# EAGLE design Teensy3.2_v3_final (EAGLE 7.6.0)
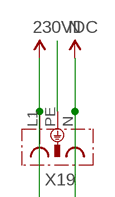
[diagram p0: schematic, sheet 1, part 1 of 3]
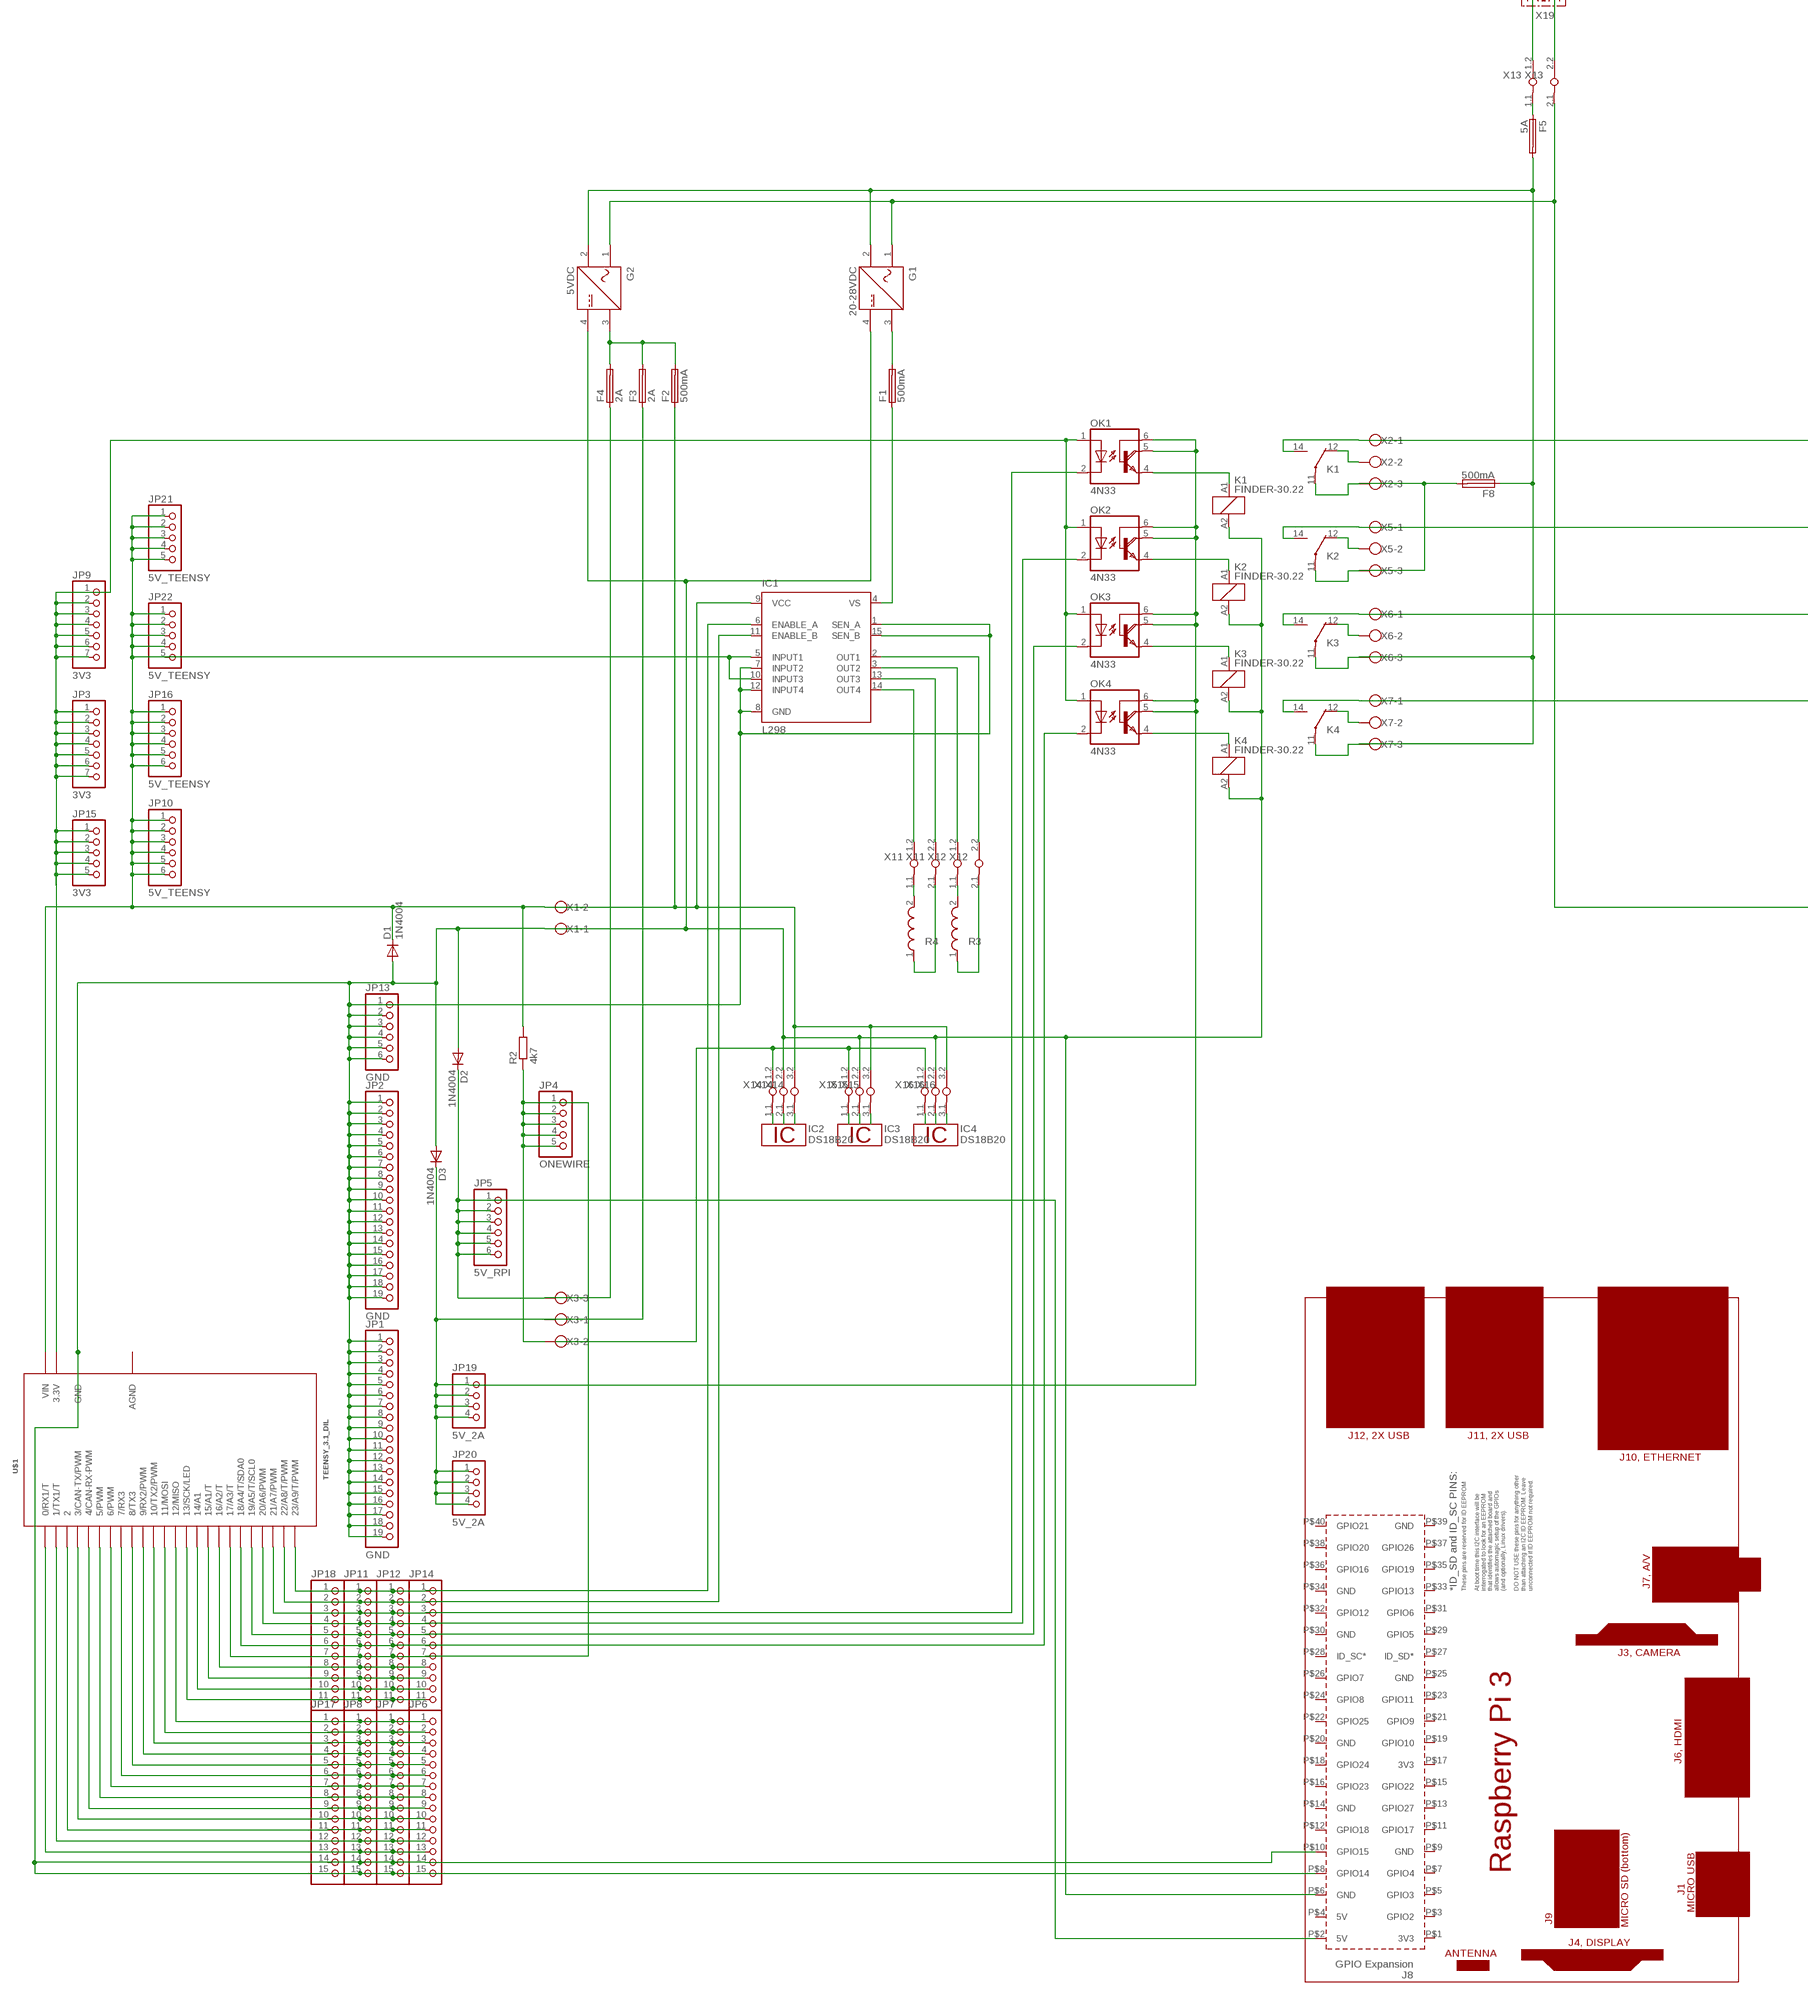
[diagram p1: schematic, sheet 1, part 2 of 3]
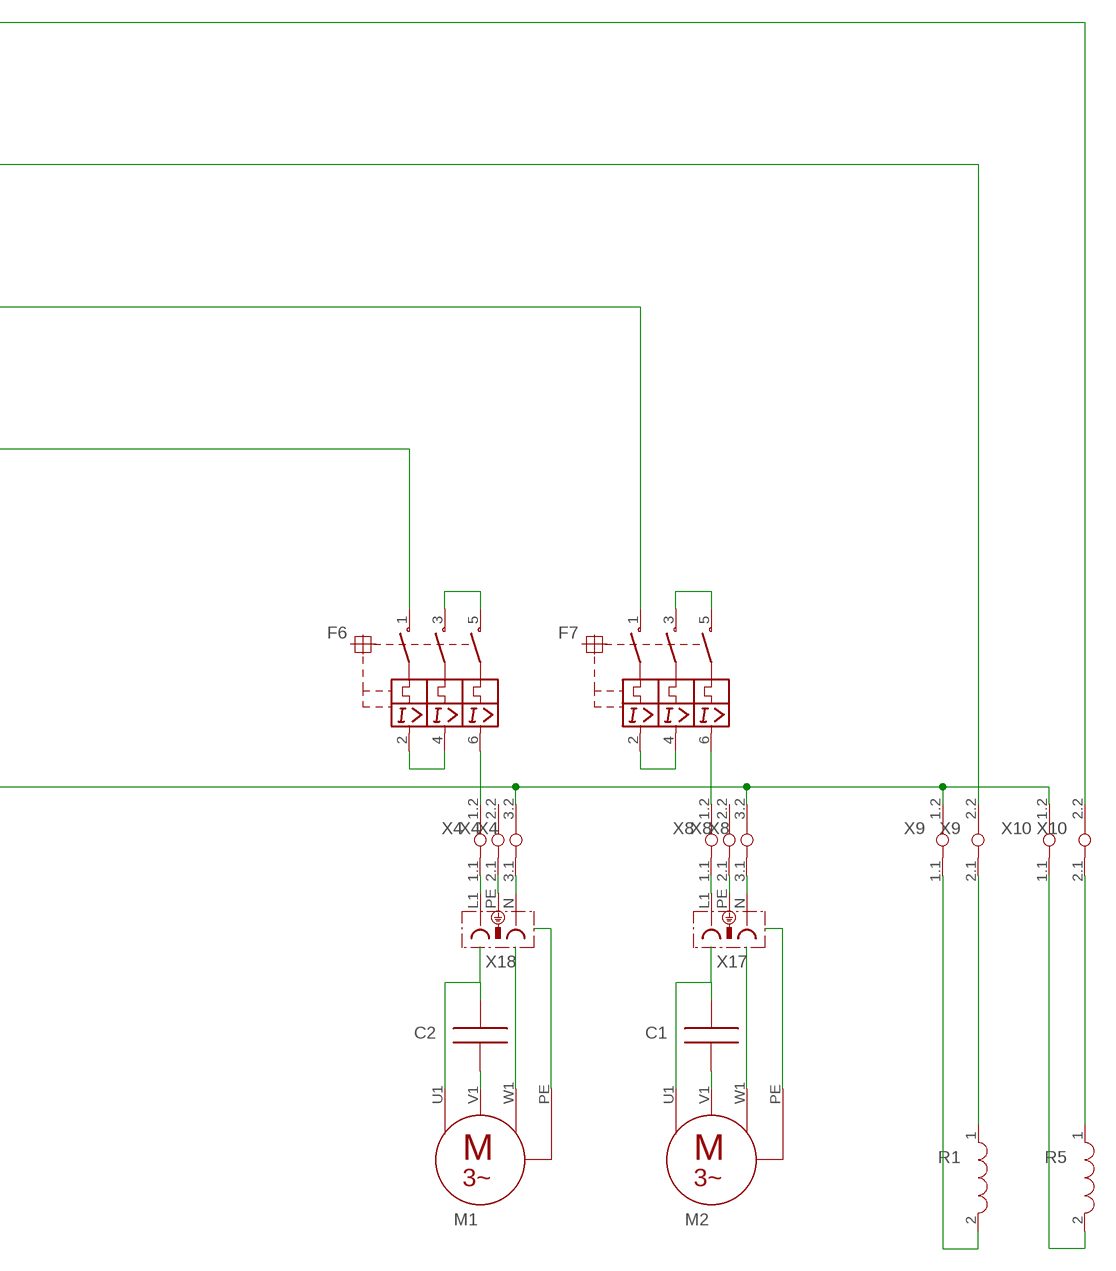
[diagram p2: schematic, sheet 1, part 3 of 3]

## Parts
C1  KONDENSATOR_KAPAZITAET_ALLGEMEIN  [KONDENSATOR_KAPAZITAET_ALLGEMEIN]
C2  KONDENSATOR_KAPAZITAET_ALLGEMEIN  [KONDENSATOR_KAPAZITAET_ALLGEMEIN]
D1  1N4004  [DO41-10]
D2  1N4004  [DO41-10]
D3  1N4004  [DO41-10]
F1  500mA  GSH15  [GSH15]
F2  500mA  GSH15  [GSH15]
F3  2A  GSH15  [GSH15]
F4  2A  GSH15  [GSH15]
F5  5A  GSH15  [GSH15]
F6  MOTORSCHUTZSCHALTER_3-POL_THERM_MAG_HANDBETAETIGT  [MOTORSCHUTZSCHALTER_3-POL_THERM_MAG_HANDBETAETIGT]
F7  MOTORSCHUTZSCHALTER_3-POL_THERM_MAG_HANDBETAETIGT  [MOTORSCHUTZSCHALTER_3-POL_THERM_MAG_HANDBETAETIGT]
F8  500mA  GSH15  [GSH15]
G1  20-28VDC  NETZTEIL_GLEICHSPANNUNG  [NETZTEIL_GLEICHSPANNUNG]
G2  5VDC  NETZTEIL_GLEICHSPANNUNG  [NETZTEIL_GLEICHSPANNUNG]
IC1  L298  [MULTIWATT-15]
IC2  DS18B20  [TO92-]
IC3  DS18B20  [TO92-]
IC4  DS18B20  [TO92-]
JP1  GND  PINHD-1X19  [1X19]
JP2  GND  PINHD-1X19  [1X19]
JP3  3V3  PINHD-1X7  [1X07]
JP4  ONEWIRE  PINHD-1X5  [1X05]
JP5  5V_RPI  PINHD-1X6  [1X06]
JP6  PINHD-1X15  [1X15]
JP7  PINHD-1X15  [1X15]
JP8  PINHD-1X15  [1X15]
JP9  3V3  PINHD-1X7  [1X07]
JP10  5V_TEENSY  PINHD-1X6  [1X06]
JP11  PINHD-1X11  [1X11]
JP12  PINHD-1X11  [1X11]
JP13  GND  PINHD-1X6  [1X06]
JP14  PINHD-1X11  [1X11]
JP15  3V3  PINHD-1X5  [1X05]
JP16  5V_TEENSY  PINHD-1X6  [1X06]
JP17  PINHD-1X15  [1X15]
JP18  PINHD-1X11  [1X11]
JP19  5V_2A  PINHD-1X4  [1X04]
JP20  5V_2A  PINHD-1X4  [1X04]
JP21  5V_TEENSY  PINHD-1X5  [1X05]
JP22  5V_TEENSY  PINHD-1X5  [1X05]
K1  FINDER-30.22  [FINDER-30.22]
K2  FINDER-30.22  [FINDER-30.22]
K3  FINDER-30.22  [FINDER-30.22]
K4  FINDER-30.22  [FINDER-30.22]
M1  MOTOR_3-POL_PE  [MOTOR_3-POL_PE]
M2  MOTOR_3-POL_PE  [MOTOR_3-POL_PE]
OK1  4N33  [DIL06]
OK2  4N33  [DIL06]
OK3  4N33  [DIL06]
OK4  4N33  [DIL06]
PCB1  RPI3  [RPI3]
R1  SPULE_ALTERNATIV  [SPULE]
R2  4k7  R-EU_0204/5  [0204/5]
R3  SPULE_ALTERNATIV  [SPULE]
R4  SPULE_ALTERNATIV  [SPULE]
R5  SPULE_ALTERNATIV  [SPULE]
U$1  TEENSY_3.1_DIL  [TEENSY3-DIL]
X1  W237-102  [W237-102]
X2  W237-103  [W237-103]
X3  W237-103  [W237-103]
X4  KLEMME_1-3  [KLEMME_1-3]
X5  W237-103  [W237-103]
X6  W237-103  [W237-103]
X7  W237-103  [W237-103]
X8  KLEMME_1-3  [KLEMME_1-3]
X9  KLEMME_1-2  [KLEMME_1-2]
X10  KLEMME_1-2  [KLEMME_1-2]
X11  KLEMME_1-2  [KLEMME_1-2]
X12  KLEMME_1-2  [KLEMME_1-2]
X13  KLEMME_1-2  [KLEMME_1-2]
X14  KLEMME_1-3  [KLEMME_1-3]
X15  KLEMME_1-3  [KLEMME_1-3]
X16  KLEMME_1-3  [KLEMME_1-3]
X17  STECKDOSE  [STECKDOSE]
X18  STECKDOSE  [STECKDOSE]
X19  STECKDOSE  [STECKDOSE]

## Nets
0V: D1.A D2.A D3.A G1.4 G2.4 IC1.1(SEN_A) IC1.7(INPUT2) IC1.8(GND) IC1.12(INPUT4) IC1.15(SEN_B) JP1.1 JP1.2 JP1.3 JP1.4 JP1.5 JP1.6 JP1.7 JP1.8 JP1.9 JP1.10 JP1.11 JP1.12 JP1.13 JP1.14 JP1.15 JP1.16 JP1.17 JP1.18 JP1.19 JP2.1 JP2.2 JP2.3 JP2.4 JP2.5 JP2.6 JP2.7 JP2.8 JP2.9 JP2.10 JP2.11 JP2.12 JP2.13 JP2.14 JP2.15 JP2.16 JP2.17 JP2.18 JP2.19 JP6.14 JP6.15 JP7.14 JP7.15 JP8.14 JP8.15 JP13.1 JP13.2 JP13.3 JP13.4 JP13.5 JP13.6 JP17.14 JP17.15 K1.A2 K2.A2 K3.A2 K4.A2 PCB1.P$6(GND) PCB1.P$8(GPIO14) PCB1.P$10(GPIO15) U$1.GND X1.1 X14.2.2(2:2.2) X15.2.2(2:2.2) X16.2.2(2:2.2)
5V_0,5A: D1.C F2.1 IC1.5(INPUT1) IC1.9(VCC) IC1.10(INPUT3) JP10.1 JP10.2 JP10.3 JP10.4 JP10.5 JP10.6 JP16.1 JP16.2 JP16.3 JP16.4 JP16.5 JP16.6 JP21.1 JP21.2 JP21.3 JP21.4 JP21.5 JP22.1 JP22.2 JP22.3 JP22.4 JP22.5 R2.2 U$1.VIN X1.2 X14.3.2(3:3.2) X15.3.2(3:3.2) X16.3.2(3:3.2)
5V_1A: D3.C F3.1 JP19.1 JP19.2 JP19.3 JP19.4 JP20.1 JP20.2 JP20.3 JP20.4 OK1.5(COL) OK1.6(B) OK2.5(COL) OK2.6(B) OK3.5(COL) OK3.6(B) OK4.5(COL) OK4.6(B) X3.1
5V_2A: D2.C F4.1 JP5.1 JP5.2 JP5.3 JP5.4 JP5.5 JP5.6 PCB1.P$2(5V) X3.3
N$1: JP4.1 JP4.2 JP4.3 JP4.4 JP4.5 JP11.7 JP12.7 JP14.7 JP18.7 R2.1 U$1.17/A3(17/A3/T) X3.2
N$2: F8.2 K1.11(-1:P) K2.11(-1:P) X2.3 X5.3
N$3: X19.PE
N$4: R4.2 X11.1.1(1:1.1)
N$5: JP6.13 JP7.13 JP8.13 JP17.13 U$1.0(0/RX1/T)
N$6: X14.1.2(1:1.2) X15.1.2(1:1.2) X16.1.2(1:1.2)
N$7: JP6.11 JP7.11 JP8.11 JP17.11 U$1.2
N$8: JP6.10 JP7.10 JP8.10 JP17.10 U$1.3(3/CAN-TX/PWM)
N$9: JP6.9 JP7.9 JP8.9 JP17.9 U$1.4(4/CAN-RX-PWM)
N$10: JP6.8 JP7.8 JP8.8 JP17.8 U$1.5(5/PWM)
N$11: JP6.7 JP7.7 JP8.7 JP17.7 U$1.6(6/PWM)
N$12: JP6.6 JP7.6 JP8.6 JP17.6 U$1.7(7/RX3)
N$13: JP6.5 JP7.5 JP8.5 JP17.5 U$1.8(8/TX3)
N$14: JP6.4 JP7.4 JP8.4 JP17.4 U$1.9(9/RX2/PWM)
N$15: JP6.3 JP7.3 JP8.3 JP17.3 U$1.10(10/TX2/PWM)
N$16: JP6.2 JP7.2 JP8.2 JP17.2 U$1.11(11/MOSI)
N$17: R4.1 X11.2.1(2:2.1)
N$18: JP6.1 JP7.1 JP8.1 JP17.1 U$1.12(12/MISO)
N$19: JP11.11 JP12.11 JP14.11 JP18.11 U$1.13(13/SCK/LED)
N$20: JP11.10 JP12.10 JP14.10 JP18.10 U$1.14/A0(14/A1)
N$21: JP11.9 JP12.9 JP14.9 JP18.9 U$1.15/A1(15/A1/T)
N$22: JP11.8 JP12.8 JP14.8 JP18.8 U$1.16/A2(16/A2/T)
N$23: F1.2 G1.3
N$24: JP11.6 JP12.6 JP14.6 JP18.6 OK4.2(C) U$1.18/A4(18/A4/T/SDA0)
N$25: R3.2 X12.1.1(1:1.1)
N$26: JP11.5 JP12.5 JP14.5 JP18.5 OK3.2(C) U$1.19/A5(19/A5/T/SCL0)
N$27: JP11.4 JP12.4 JP14.4 JP18.4 OK2.2(C) U$1.20/A6(20/A6/PWM)
N$28: JP11.3 JP12.3 JP14.3 JP18.3 OK1.2(C) U$1.21/A7(21/A7/PWM)
N$29: IC1.11(ENABLE_B) JP11.2 JP12.2 JP14.2 JP18.2 U$1.22/A8(22/A8/T/PWM)
N$30: IC1.6(ENABLE_A) JP11.1 JP12.1 JP14.1 JP18.1 U$1.23/A9(23/A9/T/PWM)
N$31: K1.A1 OK1.4(E)
N$32: JP6.12 JP7.12 JP8.12 JP17.12 U$1.1(1/TX1/T)
N$33: JP3.1 JP3.2 JP3.3 JP3.4 JP3.5 JP3.6 JP3.7 JP9.1 JP9.2 JP9.3 JP9.4 JP9.5 JP9.6 JP9.7 JP15.1 JP15.2 JP15.3 JP15.4 JP15.5 OK1.1(A) OK2.1(A) OK3.1(A) OK4.1(A) U$1.3.3V
N$34: R3.1 X12.2.1(2:2.1)
N$35: F5.1 X13.1.1(1:1.1)
N$37: K1.12(-1:O) X2.2
N$38: F5.2 F8.1 G1.2 G2.2 K3.11(-1:P) K4.11(-1:P) X6.3 X7.3
N$39: F6.2 F6.4
N$40: K4.A1 OK4.4(E)
N$41: K3.A1 OK3.4(E)
N$42: K2.A1 OK2.4(E)
N$43: F6.3 F6.5
N$44: F6.6 X4.1.2(1:1.2)
N$45: F6.1 F7.1 K2.14(-1:S) X5.1 X9.2.2(2:2.2)
N$46: K2.12(-1:O) X5.2
N$47: F7.2 F7.4
N$48: K3.14(-1:S) X6.1
N$49: K3.12(-1:O) X6.2
N$50: F7.3 F7.5
N$51: K4.14(-1:S) X7.1
N$52: K4.12(-1:O) X7.2
N$53: X4.1.1(1:1.1) X18.L1
N$54: C2.2 M1.V1
N$55: C1.2 M2.V1
N$57: K1.14(-1:S) X2.1 X10.2.2(2:2.2)
N$58: C2.1 M1.U1
N$59: X4.2.1(2:2.1) X18.PE
N$60: C1.1 M2.U1
N$61: X4.3.1(3:3.1) X18.N
N$62: R1.2 X9.1.1(1:1.1)
N$63: R1.1 X9.2.1(2:2.1)
N$64: R5.2 X10.1.1(1:1.1)
N$65: R5.1 X10.2.1(2:2.1)
N$66: X8.3.1(3:3.1) X17.N
N$67: X8.1.1(1:1.1) X17.L1
N$68: IC1.14(OUT4)
N$69: IC1.13(OUT3) X11.2.2(2:2.2)
N$70: IC1.3(OUT2)
N$71: IC1.2(OUT1) X12.2.2(2:2.2)
N$74: G1.1 G2.1 X4.3.2(3:3.2) X8.3.2(3:3.2) X9.1.2(1:1.2) X10.1.2(1:1.2) X13.2.1(2:2.1)
N$75: F1.1 IC1.4(VS)
N$76: F2.2 F3.2 F4.2 G2.3
N$78: X14.1.1(1:1.1)
N$79: X14.2.1(2:2.1)
N$80: X14.3.1(3:3.1)
N$81: X15.1.1(1:1.1)
N$82: X15.2.1(2:2.1)
N$83: X15.3.1(3:3.1)
N$84: X16.1.1(1:1.1)
N$85: X16.2.1(2:2.1)
N$86: X16.3.1(3:3.1)
N$87: F7.6 X8.1.2(1:1.2)
N$88: X8.2.1(2:2.1) X17.PE
N$89: M1.W1
N$90: M1.PE
N$91: M2.W1
N$92: M2.PE
VCC: X13.1.2(1:1.2) X13.2.2(2:2.2) X19.L1 X19.N ; supply symbol labelled 230VDC, N
Unconnected: K1.21(-2:P) K1.22(-2:O) K1.24(-2:S) K2.21(-2:P) K2.22(-2:O) K2.24(-2:S) K3.21(-2:P) K3.22(-2:O) K3.24(-2:S) K4.21(-2:P) K4.22(-2:O) K4.24(-2:S) PCB1.P$1(3V3) PCB1.P$3(GPIO2) PCB1.P$4(5V) PCB1.P$5(GPIO3) PCB1.P$7(GPIO4) PCB1.P$9(GND) PCB1.P$11(GPIO17) PCB1.P$12(GPIO18) PCB1.P$13(GPIO27) PCB1.P$14(GND) PCB1.P$15(GPIO22) PCB1.P$16(GPIO23) PCB1.P$17(3V3) PCB1.P$18(GPIO24) PCB1.P$19(GPIO10) PCB1.P$20(GND) PCB1.P$21(GPIO9) PCB1.P$22(GPIO25) PCB1.P$23(GPIO11) PCB1.P$24(GPIO8) PCB1.P$25(GND) PCB1.P$26(GPIO7) PCB1.P$27(ID_SD*) PCB1.P$28(ID_SC*) PCB1.P$29(GPIO5) PCB1.P$30(GND) PCB1.P$31(GPIO6) PCB1.P$32(GPIO12) PCB1.P$33(GPIO13) PCB1.P$34(GND) PCB1.P$35(GPIO19) PCB1.P$36(GPIO16) PCB1.P$37(GPIO26) PCB1.P$38(GPIO20) PCB1.P$39(GND) PCB1.P$40(GPIO21) X4.2.2(2:2.2) X8.2.2(2:2.2) X11.1.2(1:1.2) X12.1.2(1:1.2)

## Power pins joined to a net without a drawn wire
1W: IC2.2 IC3.2 IC4.2
AGND: U$1.AGND
GND: IC2.1 IC3.1 IC4.1
VDD: IC2.3 IC3.3 IC4.3

## Library data of the parts
C1 C2 = e-kondensatoren:KONDENSATOR_KAPAZITAET_ALLGEMEIN: Kondensator / Kapazität allgemein
D1-D3 = diode:1N4004: DIODE general purpose rectifier, 1 A
F1-F5 F8 = fuse:GSH15: FUSE HOLDER grid 15mm, 19649 Wickmann; MPN: 64900001039; OC_FARNELL: 1271673; OC_NEWARK: 02P0318
F6 F7 = e-motorschutzschalter:MOTORSCHUTZSCHALTER_3-POL_THERM_MAG_HANDBETAETIGT: Motorschutzschalter 3-pol. mit thermischer Auslösung, Handbetätigt
G1 G2 = e-stromversorgungselemente:NETZTEIL_GLEICHSPANNUNG: Netzteil, Gleichspannung
IC1 = st-microelectronics:L298: DUAL FULL-BRIDGE DRIVER; MPN: L298N; OC_FARNELL: 1589425; OC_NEWARK: 32M1527
IC2-IC4 = 1wire:DS18B20: Programmable Resolution Digital Thermometer This chip provides a onewire thermosensor with approx. 0.5°C accuracy. A programmable over/undertemperure alarm is available. The precision can be set from 9..12 bits. Notes: Vdd must be applied for accurate measurements at low temperatures, as the parasite power circuit otherwise heats the sensor. If parasite power is used, Vdd has to be connected to GND. The DS1822 is a low-cost thermometer chip, the DS18S20 is similar to the DS18B20, but with 9 Bit precision only. Author: Jan Kandziora <jjj@gmx.de>
JP1 JP2 = pinhead:PINHD-1X19: PIN HEADER
JP3 JP9 = pinhead:PINHD-1X7: PIN HEADER
JP4 JP15 JP21 JP22 = pinhead:PINHD-1X5: PIN HEADER
JP5 JP10 JP13 JP16 = pinhead:PINHD-1X6: PIN HEADER
JP6-JP8 JP17 = pinhead:PINHD-1X15: PIN HEADER
JP11 JP12 JP14 JP18 = pinhead:PINHD-1X11: PIN HEADER
JP19 JP20 = pinhead:PINHD-1X4: PIN HEADER
K1-K4 = relay:FINDER-30.22: SUBMINIATURE DIL-RELAIS FINDER 30.22.9.024.0000 Kontakt max. AC - 125V Distributor: Farnell Bestell Nr.: 1217371 Source: http://www.farnell.com/datasheets/87634.pdf; OC_FARNELL: unknown; OC_NEWARK: unknown
M1 M2 = e-motoren:MOTOR_3-POL_PE: 3-Phasen-Motor mit PE
OK1-OK4 = optocoupler:4N33: MOTOROLA OPTO COUPLER; MF: VISHAY/TELEFUNKEN; MPN: 4N33; OC_FARNELL: 1469601; OC_NEWARK: 88K1390
PCB1 = e14_Rpi3_RevA:RPI3: Device for Raspberry Pi 3 board created by Dave Young for www.element14.com More information and support community is available at https://www.element14.com/community/community/raspberry-pi
R1 R3-R5 = e-spulen-transformatoren:SPULE_ALTERNATIV: Spule alternativ
R2 = rcl:R-EU_: RESISTOR, European symbol
U$1 = Teensy_3_and_LC_Series_Boards_v1.1:TEENSY_3.1_DIL: Teensy 3.1 or 3.2 in a DIL Layout.
X1 = con-wago-500:W237-102: WAGO SCREW CLAMP; MPN: 237-102; OC_FARNELL: unknown; OC_NEWARK: 70K9898
X2 X3 X5-X7 = con-wago-500:W237-103: WAGO SCREW CLAMP; MPN: 237-103; OC_FARNELL: unknown; OC_NEWARK: 18M7116
X4 X8 X14-X16 = e-klemmen:KLEMME_1-3: Klemme 3 Pol.
X9-X13 = e-klemmen:KLEMME_1-2: Klemme 2 Pol.
X17-X19 = e-steckverbinder:STECKDOSE: Steckdose mit Schutzleiter

## Board
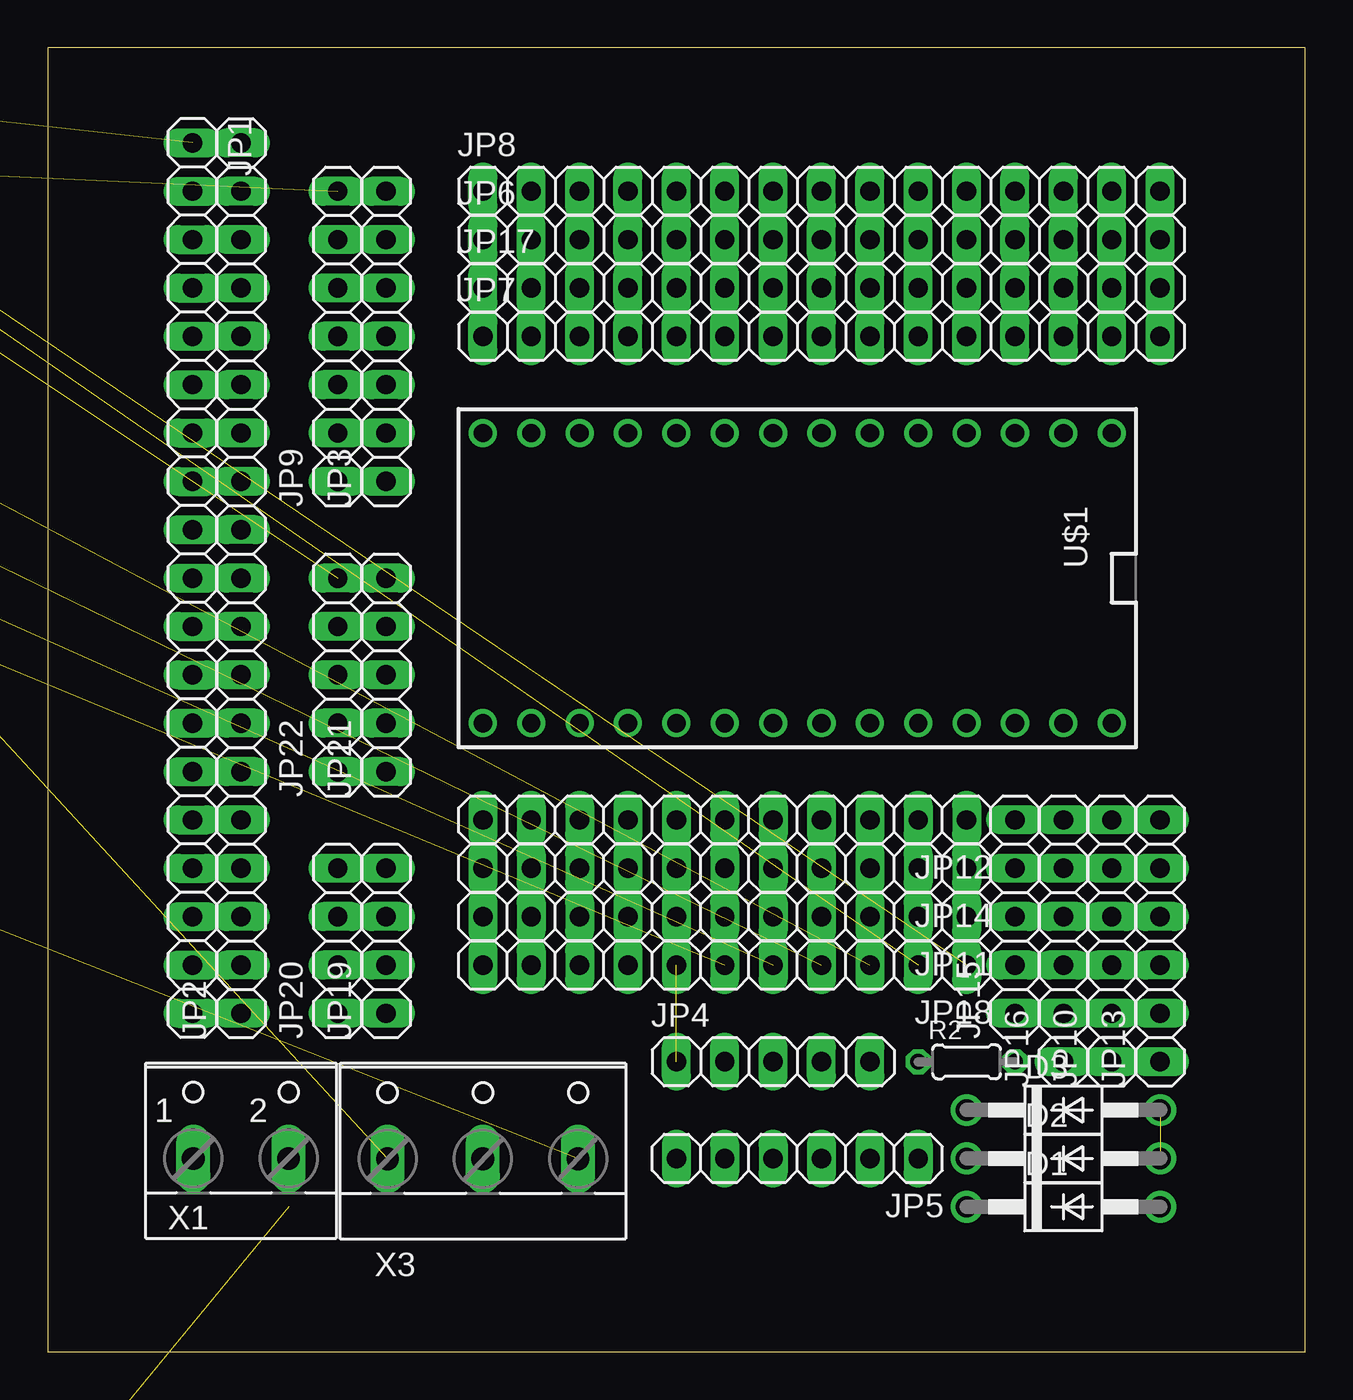
[diagram p3: board, top side]
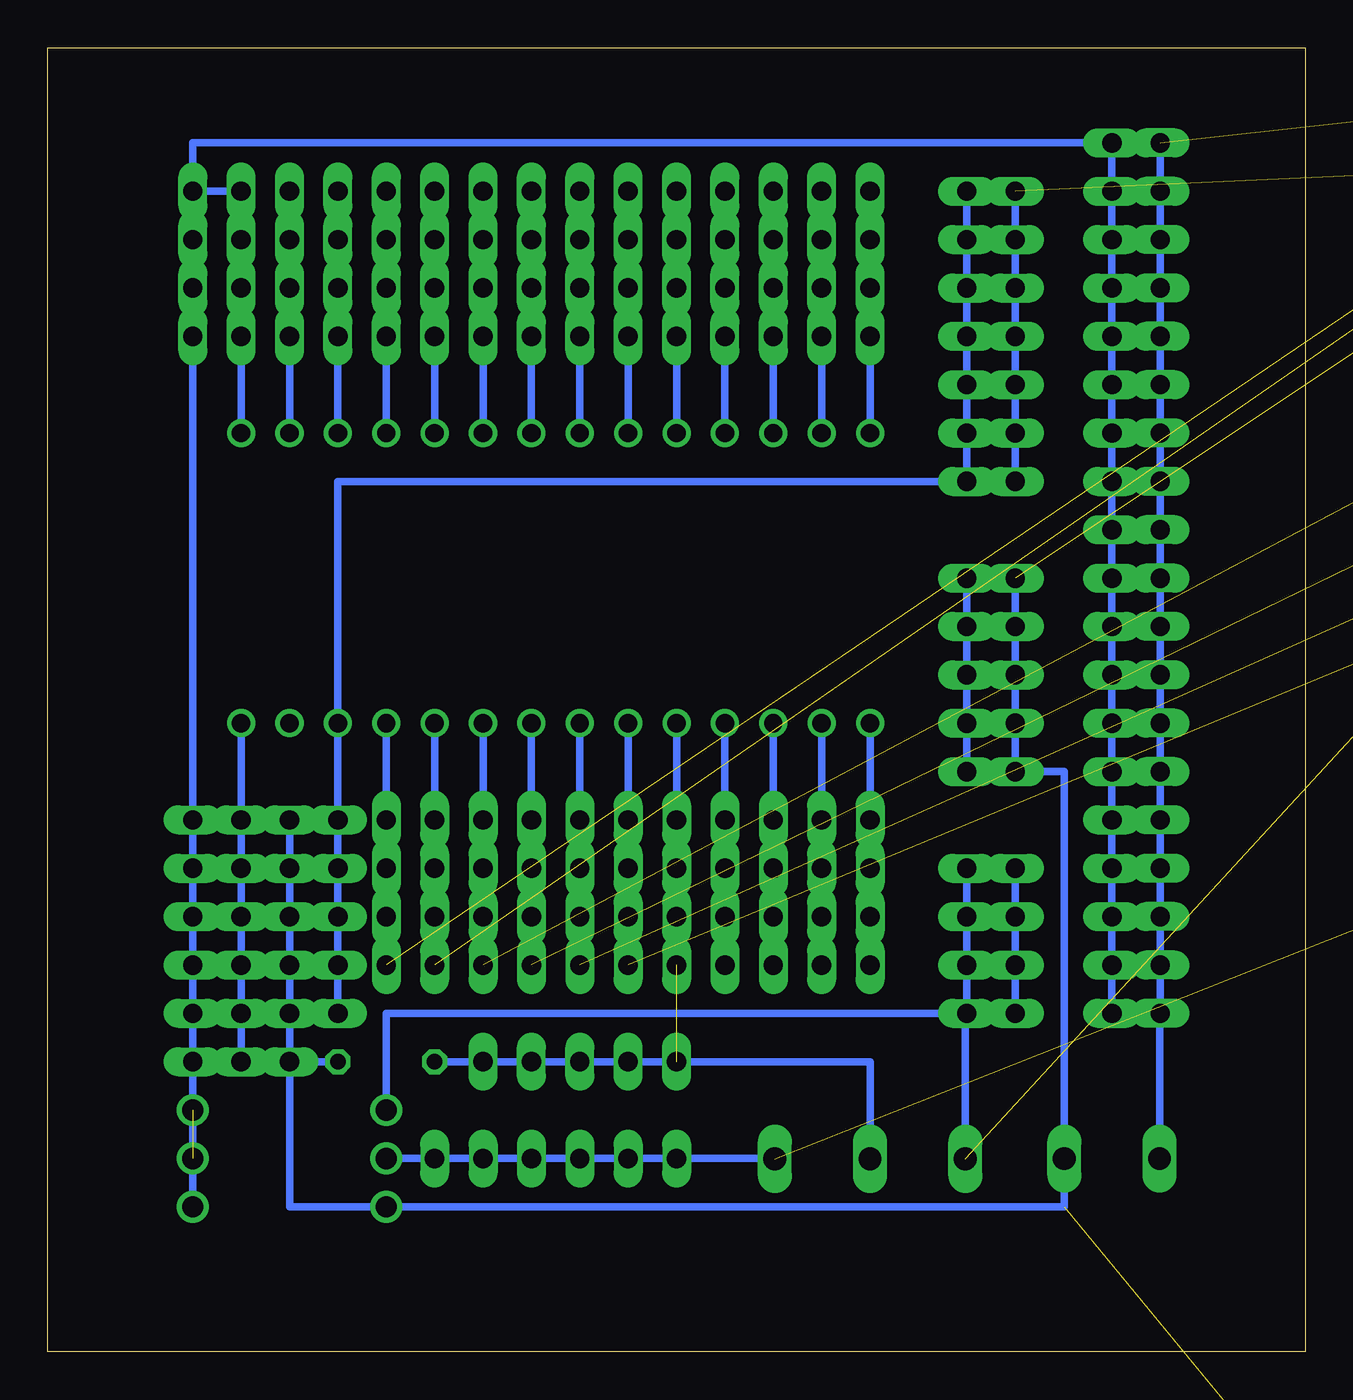
[diagram p4: board, bottom side, seen from below]

Size 66.03 x 68.5 mm. Coordinates in mm from the lower left corner, seen from the top.
Outline: 66.03,0 66.03,68.5 0,68.5 0,0 66.03,0
Copper layers (1*16): Top 0.035mm / dielectric 1.5mm / Bottom 0.035mm
Design rules "default": minimum track width 10mil, minimum drill 24mil, track to track 8mil, track to pad 8mil, pad to pad 8mil, via to via 8mil, smd to smd 8mil, copper to edge 40mil, drill to drill 8mil, minimum pad ring 10mil, minimum via ring 8mil, stop-mask expansion 4mil, vias tented up to drill 0mil, thermal gap 10mil

### Footprints (pad centres in the part's own frame; a part is rotated, then mirrored left to right if it is on the bottom)
KONDENSATOR_KAPAZITAET_ALLGEMEIN = drill 0.2 pad 0.6 square: 1 -5.08,0; 2 5.08,0
DO41-10 = drill 1.118: A 5.08,0; C -5.08,0
GSH15 = drill 1.321 pad 2.54 long: 1 -7.62,0; 2 7.62,0 | hole 2.794: 0,0
MOTORSCHUTZSCHALTER_3-POL_THERM_MAG_HANDBETAETIGT = drill 0.5 pad 1 square: 1 -5.08,0; 2 -5.08,-20.32; 3 0,0; 4 0,-20.32; 5 5.08,0; 6 5.08,-20.32
NETZTEIL_GLEICHSPANNUNG = drill 0.5 pad 1 square: 1 -10.16,-5.08; 2 -10.16,-10.16; 3 10.16,-5.08; 4 10.16,-10.16
MULTIWATT-15 = drill 1.2 long: 1 -8.89,-7.62; 2 -7.62,-2.54; 3 -6.35,-7.62; 4 -5.08,-2.54; 5 -3.81,-7.62; 6 -2.54,-2.54; 7 -1.27,-7.62; 8 0,-2.54; 9 1.27,-7.62; 10 2.54,-2.54; 11 3.81,-7.62; 12 5.08,-2.54; 13 6.35,-7.62; 14 7.62,-2.54; 15 8.89,-7.62
TO92- = drill 0.813 octagon: 1 -2.54,0; 2 0,0; 3 2.54,0
1X19 = drill 1.016 long: 1 -22.86,0; 2 -20.32,0; 3 -17.78,0; 4 -15.24,0; 5 -12.7,0; 6 -10.16,0; 7 -7.62,0; 8 -5.08,0; 9 -2.54,0; 10 0,0; 11 2.54,0; 12 5.08,0; 13 7.62,0; 14 10.16,0; 15 12.7,0; 16 15.24,0; 17 17.78,0; 18 20.32,0; 19 22.86,0
1X07 = drill 1.016 long: 1 -7.62,0; 2 -5.08,0; 3 -2.54,0; 4 0,0; 5 2.54,0; 6 5.08,0; 7 7.62,0
1X05 = drill 1.016 long: 1 -5.08,0; 2 -2.54,0; 3 0,0; 4 2.54,0; 5 5.08,0
1X06 = drill 1.016 long: 1 -6.35,0; 2 -3.81,0; 3 -1.27,0; 4 1.27,0; 5 3.81,0; 6 6.35,0
1X15 = drill 1.016 long: 1 -17.78,0; 2 -15.24,0; 3 -12.7,0; 4 -10.16,0; 5 -7.62,0; 6 -5.08,0; 7 -2.54,0; 8 0,0; 9 2.54,0; 10 5.08,0; 11 7.62,0; 12 10.16,0; 13 12.7,0; 14 15.24,0; 15 17.78,0
1X11 = drill 1.016 long: 1 -12.7,0; 2 -10.16,0; 3 -7.62,0; 4 -5.08,0; 5 -2.54,0; 6 0,0; 7 2.54,0; 8 5.08,0; 9 7.62,0; 10 10.16,0; 11 12.7,0
1X04 = drill 1.016 long: 1 -3.81,0; 2 -1.27,0; 3 1.27,0; 4 3.81,0
FINDER-30.22 = drill 1 pad 1.6: 11 -1.27,-3.81; 12 3.81,-3.81; 14 8.89,-3.81; 21 -1.27,3.81; 22 3.81,3.81; 24 8.89,3.81; A1 -8.89,-3.81; A2 -8.89,3.81
MOTOR_3-POL_PE = drill 0.2 pad 0.6 square: PE 10.16,10.16; U1 -5.08,10.16; V1 0,10.16; W1 5.08,10.16
DIL06 = drill 0.813 offset: 1 -2.54,-3.81; 2 0,-3.81; 3 2.54,-3.81; 4 2.54,3.81; 5 0,3.81; 6 -2.54,3.81
RPI3 = drill 1.016 square: P$1 8.37,51.23 | drill 1.016: P$2 8.357,53.772; P$3 10.897,51.232; P$4 10.897,53.772; P$5 13.437,51.232; P$6 13.437,53.772; P$7 15.977,51.232; P$8 15.977,53.772; P$9 18.517,51.232; P$10 18.517,53.772; P$11 21.057,51.232; P$12 21.057,53.772; P$13 23.597,51.232; P$14 23.597,53.772; P$15 26.137,51.232; P$16 26.137,53.772; P$17 28.677,51.232; P$18 28.677,53.772; P$19 31.217,51.232; P$20 31.217,53.772; P$21 33.757,51.232; P$22 33.757,53.772; P$23 36.297,51.232; P$24 36.297,53.772; P$25 38.837,51.232; P$26 38.837,53.772; P$27 41.377,51.232; P$28 41.377,53.772; P$29 43.917,51.232; P$30 43.917,53.772; P$31 46.457,51.232; P$32 46.457,53.772; P$33 48.997,51.232; P$34 48.997,53.772; P$35 51.537,51.232; P$36 51.537,53.772; P$37 54.077,51.232; P$38 54.077,53.772; P$39 56.617,51.232; P$40 56.617,53.772 | hole 2.75: 3.5,3.5; 61.5,3.5; 3.5,52.5; 61.5,52.5
SPULE = drill 0.2 pad 0.6 square: 1 0,2.54; 2 0,-2.54
0204/5 = drill 0.813 octagon: 1 -2.54,0; 2 2.54,0
TEENSY3-DIL = drill 0.965: 0 -7.62,13.97; 1 -7.62,11.43; 2 -7.62,8.89; 3 -7.62,6.35; 3.3V 7.62,11.43; 4 -7.62,3.81; 5 -7.62,1.27; 6 -7.62,-1.27; 7 -7.62,-3.81; 8 -7.62,-6.35; 9 -7.62,-8.89; 10 -7.62,-11.43; 11 -7.62,-13.97; 12 -7.62,-16.51; 13 7.62,-16.51; 14/A0 7.62,-13.97; 15/A1 7.62,-11.43; 16/A2 7.62,-8.89; 17/A3 7.62,-6.35; 18/A4 7.62,-3.81; 19/A5 7.62,-1.27; 20/A6 7.62,1.27; 21/A7 7.62,3.81; 22/A8 7.62,6.35; 23/A9 7.62,8.89; AGND 7.62,13.97; GND -7.62,16.51; VIN 7.62,16.51
W237-102 = drill 1.194 long: 1 -2.5,-1.27; 2 2.5,-1.27
W237-103 = drill 1.194 long: 1 -5,-1.29; 2 0,-1.29; 3 5,-1.29
KLEMME_1-3 = drill 0.5 pad 1 square: 1.1 0,-12.7; 1.2 0,-2.54; 2.1 2.54,-12.7; 2.2 2.54,-2.54; 3.1 5.08,-12.7; 3.2 5.08,-2.54
KLEMME_1-2 = drill 0.5 pad 1 square: 1.1 0,-12.7; 1.2 0,-2.54; 2.1 2.54,-12.7; 2.2 2.54,-2.54
STECKDOSE = drill 0.8 square: L1 -2.54,0; N 2.54,0; PE 0,-1.27

### Placement (x,y rotation side)
C1  -137.17,-187.96 0 top  (outside the outline)
C2  -137.17,-195.58 0 top  (outside the outline)
D1  53.33,7.62 0 top
D2  53.33,10.16 0 top
D3  53.33,12.7 0 top
F1  -208.29,-297.18 0 top  (outside the outline)
F2  -25.41,81.28 0 top  (outside the outline)
F3  -50.81,81.28 0 top  (outside the outline)
F4  -76.21,81.28 0 top  (outside the outline)
F5  -104.15,-48.26 0 top  (outside the outline)
F6  -124.47,-132.08 0 top  (outside the outline)
F7  -137.17,-132.08 0 top  (outside the outline)
F8  -208.29,-309.88 0 top  (outside the outline)
G1  -187.97,-243.84 0 top  (outside the outline)
G2  -187.97,-251.46 0 top  (outside the outline)
IC1  -24.14,73.66 0 top  (outside the outline)
IC2  -105.42,80.01 0 top  (outside the outline)
IC3  -114.31,80.01 0 top  (outside the outline)
IC4  -19.06,91.44 0 top  (outside the outline)
JP1  7.61,40.64 270 top
JP2  10.15,40.64 90 top
JP3  17.77,53.34 90 top
JP4  38.09,15.24 0 top
JP5  39.36,10.16 180 top
JP6  40.63,58.42 0 top
JP7  40.63,53.34 0 top
JP8  40.63,60.96 0 top
JP9  15.23,53.34 90 top
JP10  55.87,21.59 90 top
JP11  35.55,22.86 180 top
JP12  35.55,27.94 180 top
JP13  58.41,21.59 90 top
JP14  35.55,25.4 180 top
JP15  50.79,22.86 90 top
JP16  53.33,21.59 90 top
JP17  40.63,55.88 0 top
JP18  35.55,20.32 180 top
JP19  17.77,21.59 90 top
JP20  15.23,21.59 90 top
JP21  17.77,35.56 90 top
JP22  15.23,35.56 90 top
K1  -104.15,-5.08 0 top  (outside the outline)
K2  -104.15,-15.24 0 top  (outside the outline)
K3  -104.15,-25.4 0 top  (outside the outline)
K4  -104.15,-35.56 0 top  (outside the outline)
M1  -137.17,-167.64 0 top  (outside the outline)
M2  -137.17,-180.34 0 top  (outside the outline)
OK1  -38.11,67.31 0 top  (outside the outline)
OK2  -48.27,67.31 0 top  (outside the outline)
OK3  -58.43,67.31 0 top  (outside the outline)
OK4  -68.59,67.31 0 top  (outside the outline)
PCB1  -100.34,3.81 0 top  (outside the outline)
R1  -144.79,-193.04 0 top  (outside the outline)
R2  48.25,15.24 0 top
R3  -96.53,107.95 0 top  (outside the outline)
R4  -99.07,107.95 0 top  (outside the outline)
R5  -147.33,-193.04 0 top  (outside the outline)
U$1  39.36,40.64 270 top
X1  10.15,11.43 0 top
X2  -109.23,-96.52 0 top  (outside the outline)
X3  22.85,11.43 0 top
X4  -175.27,-205.74 0 top  (outside the outline)
X5  -109.23,-121.92 0 top  (outside the outline)
X6  -109.23,-134.62 0 top  (outside the outline)
X7  -109.23,-147.32 0 top  (outside the outline)
X8  -182.89,-205.74 0 top  (outside the outline)
X9  -162.57,-205.74 0 top  (outside the outline)
X10  -167.65,-205.74 0 top  (outside the outline)
X11  -187.97,-205.74 0 top  (outside the outline)
X12  -193.05,-205.74 0 top  (outside the outline)
X13  -198.13,-231.14 0 top  (outside the outline)
X14  -205.75,-248.92 0 top  (outside the outline)
X15  -213.37,-248.92 0 top  (outside the outline)
X16  -220.99,-248.92 0 top  (outside the outline)
X17  -215.91,-266.7 0 top  (outside the outline)
X18  -215.91,-276.86 0 top  (outside the outline)
X19  -215.91,-287.02 0 top  (outside the outline)

### Tracks (layer width: path | path; a pad name or v marks a point on that pad's centre or on a via)
0V  (18 unrouted)
  Bottom 0.406: D2.A D1.A JP13.1 JP13.2 JP13.3 | 58.41,21.59 JP13.3 | JP13.3 JP13.4 JP13.5 JP13.6 JP7.15 JP17.15 JP6.15 JP8.15 | JP8.15 JP8.14 JP6.14 JP17.14 JP7.14 U$1.GND | JP8.15 58.41,63.5 JP2.19 | 7.61,10.16 X1.1 7.65,17.78 JP1.19 JP1.18 JP1.17 JP1.16 JP1.15 JP1.14 JP1.13 JP1.12 JP1.11 JP1.10 JP1.9 JP1.8 JP1.7 JP1.6 JP1.5 JP1.4 JP1.3 JP1.2 JP1.1 JP2.19 | JP2.1 JP2.2 JP2.3 JP2.4 JP2.5 JP2.6 JP2.7 JP2.8 JP2.9 JP2.10 JP2.11 JP2.12 JP2.13 | JP2.13 JP2.14 JP2.15 JP2.16 JP2.17 JP2.18 JP2.19 | JP2.13 JP2.19
1W  (2 unrouted)
5V_0,5A  (7 unrouted)
  Bottom 0.406: JP21.1 JP21.2 JP21.3 JP21.4 JP21.5 JP22.5 JP22.4 JP22.3 JP22.2 JP22.1 12.65,30.48 X1.2 12.65,7.62 D1.C 53.33,7.62 JP16.1 | U$1.VIN JP10.6 JP10.5 JP10.4 | 57.14,22.86 JP10.4 | JP10.4 JP10.3 JP10.2 JP10.1 JP16.1 | JP16.1 JP16.2 JP16.3 JP16.4 JP16.5 JP16.6 | JP16.1 R2.2
5V_1A  (9 unrouted)
  Bottom 0.406: X3.1 17.85,17.78 JP19.1 | JP19.1 JP19.2 JP19.3 JP19.4 | JP19.1 JP20.1 JP20.2 JP20.4 JP20.3 | D3.C 48.25,17.78 JP19.1
5V_2A  (2 unrouted)
  Bottom 0.406: X3.3 27.85,10.16 JP5.6 JP5.5 JP5.4 JP5.3 JP5.2 JP5.1 D2.C
GND  (2 unrouted)
N$1  (1 unrouted)
  Bottom 0.406: X3.2 22.85,15.24 JP4.1 JP4.2 JP4.3 JP4.4 JP4.5 R2.1 | JP18.7 JP11.7 JP14.7 JP12.7 U$1.17/A3
N$2  (4 unrouted)
N$4  (1 unrouted)
N$5
  Bottom 0.406: U$1.0 JP7.13 JP17.13 JP6.13 JP8.13
N$6  (2 unrouted)
N$7
  Bottom 0.406: JP8.11 JP6.11 JP17.11 JP7.11 U$1.2
N$8
  Bottom 0.406: U$1.3 JP7.10 JP17.10 JP6.10 JP8.10
N$9
  Bottom 0.406: JP8.9 JP6.9 JP17.9 JP7.9 U$1.4
N$10
  Bottom 0.406: U$1.5 JP7.8 JP17.8 JP6.8 JP8.8
N$11
  Bottom 0.406: JP8.7 JP6.7 JP17.7 JP7.7 U$1.6
N$12
  Bottom 0.406: U$1.7 JP7.6 JP17.6 JP6.6 JP8.6
N$13
  Bottom 0.406: U$1.8 JP7.5 JP17.5 JP6.5 JP8.5
N$14
  Bottom 0.406: JP8.4 JP6.4 JP17.4 JP7.4 U$1.9
N$15
  Bottom 0.406: U$1.10 JP7.3 JP17.3 JP6.3 JP8.3
N$16
  Bottom 0.406: JP8.2 JP6.2 JP17.2 JP7.2 U$1.11
N$17  (1 unrouted)
N$18
  Bottom 0.406: U$1.12 JP7.1 JP17.1 JP6.1 JP8.1
N$19
  Bottom 0.406: JP18.11 JP11.11 JP14.11 JP12.11 U$1.13
N$20
  Bottom 0.406: U$1.14/A0 JP12.10 JP14.10 JP11.10 JP18.10
N$21
  Bottom 0.406: JP18.9 JP11.9 JP14.9 JP12.9 U$1.15/A1
N$22
  Bottom 0.406: U$1.16/A2 JP12.8 JP14.8 JP11.8 JP18.8
N$23  (1 unrouted)
N$24  (1 unrouted)
  Bottom 0.406: U$1.18/A4 JP12.6 JP14.6 JP11.6 JP18.6
N$25  (1 unrouted)
N$26  (1 unrouted)
  Bottom 0.406: JP18.5 JP11.5 JP14.5 JP12.5 U$1.19/A5
N$27  (1 unrouted)
  Bottom 0.406: U$1.20/A6 JP12.4 JP14.4 JP11.4 JP18.4
N$28  (1 unrouted)
  Bottom 0.406: JP18.3 JP11.3 JP14.3 JP12.3 U$1.21/A7
N$29  (1 unrouted)
  Bottom 0.406: U$1.22/A8 JP12.2 JP14.2 JP11.2 JP18.2
N$30  (1 unrouted)
  Bottom 0.406: JP18.1 JP11.1 JP14.1 JP12.1 U$1.23/A9
N$31  (1 unrouted)
N$32
  Bottom 0.406: U$1.1 JP7.12 JP17.12 JP6.12 JP8.12
N$33  (4 unrouted)
  Bottom 0.406: JP9.1 JP9.2 JP9.3 JP9.4 JP9.5 JP9.6 JP9.7 JP3.7 JP3.6 JP3.5 JP3.4 JP3.3 JP3.2 JP3.1 50.79,45.72 U$1.3.3V JP15.5 JP15.4 JP15.3 JP15.2 JP15.1
N$34  (1 unrouted)
N$35  (1 unrouted)
N$37  (1 unrouted)
N$38  (7 unrouted)
N$39  (1 unrouted)
N$40  (1 unrouted)
N$41  (1 unrouted)
N$42  (1 unrouted)
N$43  (1 unrouted)
N$44  (1 unrouted)
N$45  (4 unrouted)
N$46  (1 unrouted)
N$47  (1 unrouted)
N$48  (1 unrouted)
N$49  (1 unrouted)
N$50  (1 unrouted)
N$51  (1 unrouted)
N$52  (1 unrouted)
N$53  (1 unrouted)
N$54  (1 unrouted)
N$55  (1 unrouted)
N$57  (2 unrouted)
N$58  (1 unrouted)
N$59  (1 unrouted)
N$60  (1 unrouted)
N$61  (1 unrouted)
N$62  (1 unrouted)
N$63  (1 unrouted)
N$64  (1 unrouted)
N$65  (1 unrouted)
N$66  (1 unrouted)
N$67  (1 unrouted)
N$69  (1 unrouted)
N$71  (1 unrouted)
N$74  (6 unrouted)
N$75  (1 unrouted)
N$76  (3 unrouted)
N$87  (1 unrouted)
N$88  (1 unrouted)
VCC  (3 unrouted)
VDD  (2 unrouted)